# EasyEDA Pro project MicroHDMI_D-Type_Dummy_Plug.epro

# Schematic Schematic1
Board Name: Board1; Create Date: 2025-08-22; Page Name: P1; Project Name: MicroHDMI_D-Type_Dummy_Plug; Schematic Name: Schematic1; Update Date: 2025-08-22; Company: 嘉立创EDA; Page Size: A4; Version: V1.0
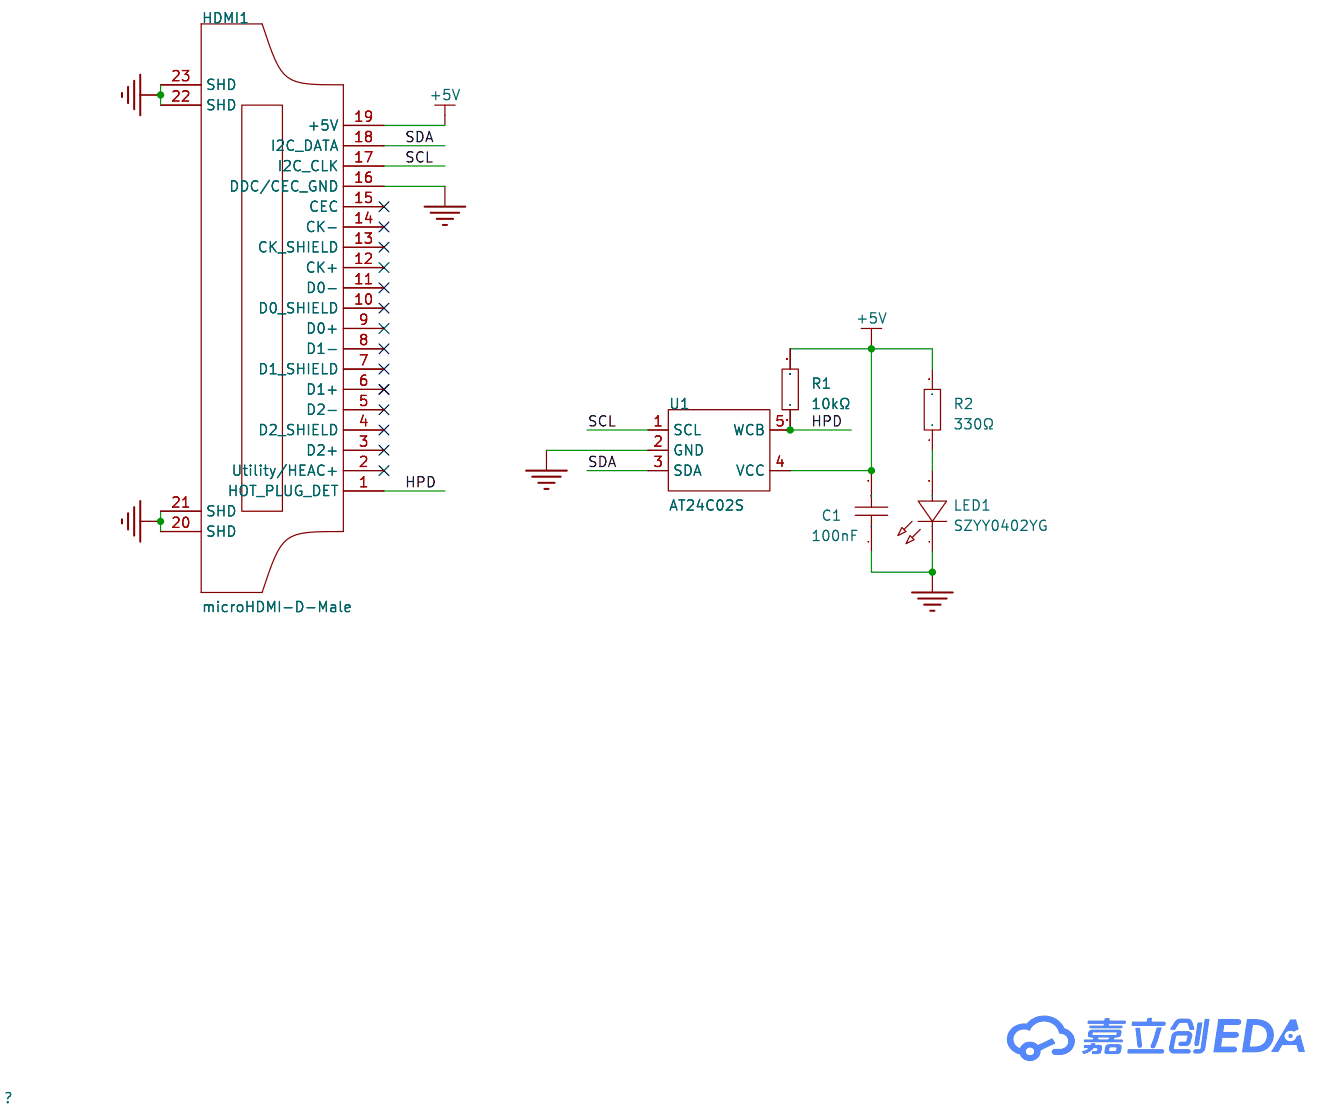
[diagram p0: schematic sheet]

## Parts
C1  100nF  [C0402]
HDMI1  microHDMI-D-Male  [HDIM-SMD_HDMI-D-Male]
LED1  SZYY0402YG  [LED0402-RD_GREEN]
R1  10kΩ  [R0402]
R2  330Ω  [R0402]
U1  AT24C02S  [SOT-23-5_L3.0-W1.7-P0.95-LS2.8-BL]

## Library data of the parts
C1 = CL05B104KO5NNNC: 容值:100nF;精度:±10%;额定电压:16V;温度系数:X7R;; LCSC Part Name: 100nF ±10% 16V; Supplier Part: C1525; Manufacturer: SAMSUNG(三星); Supplier Footprint: 0402; JLCPCB Part Class: 基础库; Datasheet: https://item.szlcsc.com/datasheet/CL05B104KO5NNNC/1877.html; Supplier: LCSC; Tolerance: ±10%; Voltage Rating: 16V; Temperature Coefficient: X7R
HDMI1 = microHDMI-D-Male: 夹板0.9镀金 2.1版本支持8k高清; Manufacturer: None; Supplier: LCSC; Supplier Part: None; Supplier Footprint: SMD; JLCPCB Part Class: Extended Part; Datasheet: None; Connector Type: HDMI-D; Gender: 公; Number of Pins: 19P; Mounting Type: 夹板; Current Rating: 500mA; Operating Temperature: -25℃~+85℃
LED1 = SZYY0402YG: 发光颜色:黄绿色;; LCSC Part Name: 普绿/黄绿; Supplier Part: C434449; Manufacturer: yongyu(永裕光电); Supplier Footprint: 0402; JLCPCB Part Class: 扩展库; Datasheet: https://atta.szlcsc.com/upload/public/pdf/source/20210222/C434449_B19755659E573AF1F9CC39D35DA2FAFF.pdf; Supplier: LCSC; Emitted Color: 黄绿色
R1 = 0402WGF1002TCE: 电阻类型:厚膜电阻;阻值:10kΩ;精度:±1%;功率:62.5mW;工作电压:50V;温度系数:±100ppm/℃;; LCSC Part Name: 10kΩ ±1% 62.5mW 厚膜电阻; Supplier Part: C25744; Manufacturer: UNI-ROYAL(厚声); Supplier Footprint: 0402; JLCPCB Part Class: 基础库; Datasheet: https://item.szlcsc.com/datasheet/0402WGF1002TCE/26487.html; Supplier: LCSC; Type: 厚膜电阻; Tolerance: ±1%; Power(Watts): 62.5mW; Voltage-Supply(Max): 50V; Temperature Coefficient: ±100ppm/℃; Operating Temperature: -55℃~+155℃
R2 = 0402WGF3300TCE: 电阻类型:厚膜电阻;阻值:330Ω;精度:±1%;功率:62.5mW;工作电压:50V;温度系数:±100ppm/℃;; LCSC Part Name: 330Ω ±1% 62.5mW 厚膜电阻; Supplier Part: C25104; Manufacturer: UNI-ROYAL(厚声); Supplier Footprint: 0402; JLCPCB Part Class: 基础库; Datasheet: https://item.szlcsc.com/datasheet/0402WGF3300TCE/25847.html; Supplier: LCSC; Type: 厚膜电阻; Tolerance: ±1%; Power(Watts): 62.5mW; Voltage-Supply(Max): 50V; Temperature Coefficient: ±100ppm/℃; Operating Temperature: -55℃~+155℃
U1 = AT24C02S: 接口类型:I2C;存储容量:2Kbit;时钟频率(fc):1MHz;; Supplier Part: C46550852; Manufacturer: TDSEMIC(拓电半导体); Supplier Footprint: SOT-23-5; JLCPCB Part Class: 扩展库; Datasheet: https://item.szlcsc.com/datasheet/AT24C02S/48682105.html; Supplier: LCSC; Interface: I2C; Memory Size: 2Kbit; Clock Frequency: 1MHz; Write Cycle Time(Tw): 5ms; Data Retention - TDR (Year): 100年; Write Cycle Endurance: 100万次; Operating Temperature: -40℃~+85℃

## Nets
+5V: C1.2 HDMI1.19(+5V) R1.2 R2.2 U1.4(VCC)
GND: C1.1 HDMI1.16(DDC/CEC_GND) HDMI1.20(SHD) HDMI1.21(SHD) HDMI1.22(SHD) HDMI1.23(SHD) LED1.1(K) U1.2(GND)
HPD: HDMI1.1(HOT_PLUG_DET) R1.1 U1.5(WCB)
SCL: HDMI1.17(I2C_CLK) U1.1(SCL)
SDA: HDMI1.18(I2C_DATA) U1.3(SDA)
$1N2501: LED1.2(A) R2.1

Not connected (* = marked no-connect by the designer): HDMI1 2(Utility/HEAC+)* 3(D2+)* 4(D2_SHIELD)* 5(D2-)* 6(D1+)* 7(D1_SHIELD)* 8(D1-)* 9(D0+)* 10(D0_SHIELD)* 11(D0-)* 12(CK+)* 13(CK_SHIELD)* 14(CK-)* 15(CEC)*

# Board PCB1
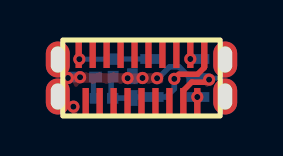
[diagram p1: board, top side]
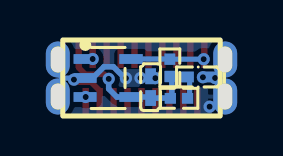
[diagram p2: board, bottom side, seen from below]

No outline. copper layers: Top Layer, Bottom Layer. Coordinates in mm from the lowest, leftmost part position.
Stack: Top Layer 0.035mm / Dielectric1 1.51mm FR4 er 4.5 / Bottom Layer 0.035mm

## Design rules (mm)
template: 自定义配置
spacing copperThickness1oz (default): track to track 0.102, other pairs 0.152 to 0.3
spacing copperThickness2oz: track to track 0.203, other pairs 0.152 to 0.3
track width copperThickness1oz (default): min 0.127, default 0.254, max 2.54
track width copperThickness2oz: min 0.203, default 0.254, max 2.54
differential pair differentialPair (default): width min 0.127, default 0.254, max 2.54; gap min 0.152, default 0.152
via viaSize (default): diameter min 0.5, default 0.61, max 10; hole min 0.3, default 0.305, max 6.3

## Placement (name value [footprint] x y rotation side)
C1  100nF  [C0402]  2.39 0.56 270 bottom
HDMI1  microHDMI-D-Male  [HDIM-SMD_HDMI-D-Male]  2.84 1.02 0 top
LED1  SZYY0402YG  [LED0402-RD_GREEN]  0 1.07 0 bottom
R1  10kΩ  [R0402]  1.42 1.52 270 bottom
R2  330Ω  [R0402]  0.97 0 0 bottom
U1  AT24C02S  [SOT-23-5_L3.0-W1.7-P0.95-LS2.8-BL]  4.52 1.02 270 bottom

## Footprints (pads in the part's own frame, mm; a bottom-side part is the same pattern mirrored in y, then rotated)
C0402
  rect 0.79x0.54 smd: 1(-0.545,0) 2(0.545,0)
HDIM-SMD_HDMI-D-Male
  rect 0.32x1.4 smd: 1(-3.15,1.2) 2(-2.8,-1.2) 3(-2.45,1.2) 4(-2.1,-1.2) 5(-1.75,1.2) 6(-1.4,-1.2) 7(-1.05,1.2) 8(-0.7,-1.2) 9(-0.35,1.2) 10(0,-1.2) 11(0.35,1.2) 12(0.7,-1.2) 13(1.05,1.2) 14(1.4,-1.2) 15(1.75,1.2) 16(2.1,-1.2) 17(2.45,1.2) 18(2.8,-1.2) 19(3.15,1.2)
  oval 1.2x1.8 hole 0.7x1.3: 20(-4.2,0.925) 21(-4.2,-0.925) 22(4.2,0.925) 23(4.2,-0.925)
LED0402-RD_GREEN
  rect 0.636x0.54 smd: 1(-0.538,0) 2(0.538,0)
R0402
  rect 0.566x0.54 smd: 1(-0.433,0) 2(0.433,0)
SOT-23-5_L3.0-W1.7-P0.95-LS2.8-BL
  rect 0.49x1.157 smd: 1(-0.95,-1.153) 2(0,-1.153) 3(0.95,-1.153)
  rect 0.49x1.175 smd: 4(0.95,1.153) 5(-0.95,1.153)

## Nets
As in the schematic.

Pads without a net: HDMI1 2 3 4 5 6 7 8 9 10 11 12 13 14 15

## Via types
v1: diameter 0.61, hole 0.305, Top Layer to Bottom Layer, 11 vias

## Routing (per net, layer and track width the routed paths; a pad name or vN(x,y) marks a point on that pad's centre or on a via; arc(x,y) is an arc through that point)
+5V: length 7.4
  Top Layer w0.28: v1(4.49,0.97) 4.72,1.2 5.66,1.2 6,1.54 HDMI1.19
  Bottom Layer w0.254: 1.32,0.02 1.3,0
  Bottom Layer w0.28: 3.37,0.07 4.08,0.07 4.49,0.48 v1(4.49,0.97) ; 3.32,0.07 2.34,0.07 2.29,0.01 1.33,0.01 1.32,0.02 1.32,1.14
GND: length 7.2
  Top Layer w0.28: v1(6.24,0.93) 6.11,0.81 5.36,0.81 4.94,0.39 HDMI1.16
  Bottom Layer w0.254: 6.79,1.01 6.8,1.01 7.04,1.25 HDMI1.22 ; 6.79,1.01 6.31,1.01 v1(6.24,0.93) ; 6.79,1.01 7.04,0.76 HDMI1.23
  Bottom Layer w0.28: 5.62,1.02 5.29,1.02 4.73,1.58 4.25,1.58 3.73,1.06 3.68,1.06 v1(3.63,1.01)
  vias: v1(-0.85,1.02) v1(-0.57,-0.42) v1(-0.24,1.05) v1(2.15,1.01) v1(2.9,1.02)
HPD: length 3.6
  Bottom Layer w0.254: 3.37,1.97 1.36,1.97 1.35,1.96 v1(-0.27,1.96)
SCL:
  vias: v1(5.29,1.97)
SDA:
  vias: v1(5.65,0.07)
$1N2501: length 1.1
  Bottom Layer w0.254: 0.43,0 0.43,0.98 0.37,1.05

## Copper pours and planes (outline as drawn; the poured copper is in the pictures)
GND on Top Layer: -1.6,2.92 7.29,2.92 7.29,-0.89 -1.6,-0.89
GND on Bottom Layer: -1.6,2.92 7.29,2.92 7.29,-0.89 -1.6,-0.89

# Board PCBA
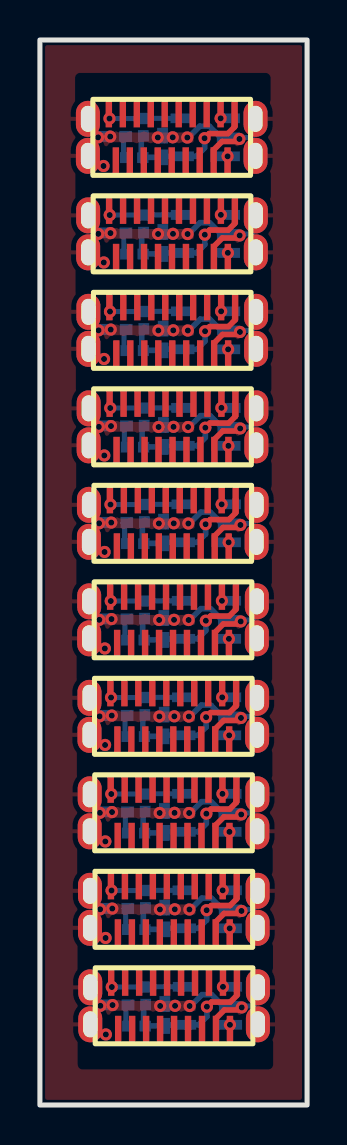
[diagram p3: board, top side]
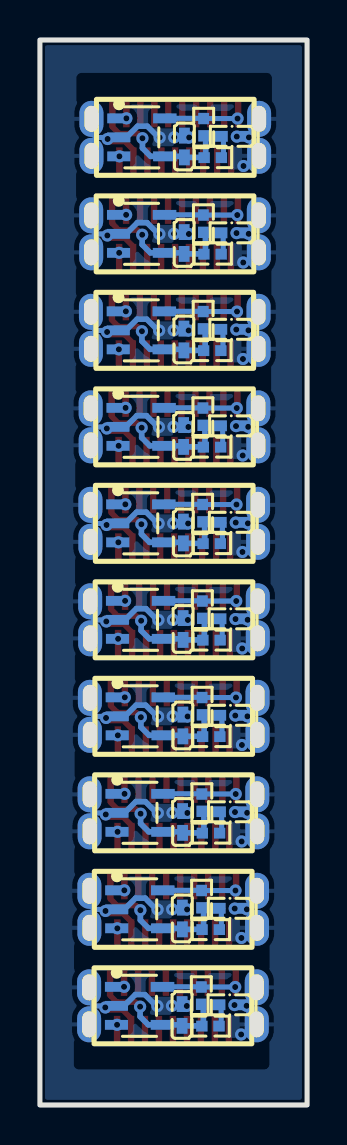
[diagram p4: board, bottom side, seen from below]

Outline 13.39 x 53.26 mm; copper layers: Top Layer, Bottom Layer. Coordinates in mm from the lower left corner of the outline.
Outline path: rectangle 0,53.26 13.39,0
Stack: Top Layer 0.035mm / Dielectric1 1.51mm FR4 er 4.5 / Bottom Layer 0.035mm

## Design rules (mm)
template: JLCPCB Capability(Two Layers Board)
spacing copperThickness1oz (default): track to track 0.102, other pairs 0.152 to 0.3
spacing copperThickness2oz: track to track 0.203, other pairs 0.152 to 0.3
track width copperThickness1oz (default): min 0.127, default 0.254, max 2.54
track width copperThickness2oz: min 0.203, default 0.254, max 2.54
differential pair differentialPair (default): width min 0.127, default 0.254, max 2.54; gap min 0.152, default 0.152
via viaSize (default): diameter min 0.5, default 0.61, max 10; hole min 0.3, default 0.305, max 6.3

## Placement (name value [footprint] x y rotation side)
C1  -  [C0402]  6.15 47.94 270 bottom
C1#2  -  [C0402]  6.16 43.11 270 bottom
C1#3  -  [C0402]  6.17 38.29 270 bottom
C1#4  -  [C0402]  6.19 33.46 270 bottom
C1#5  -  [C0402]  6.2 28.63 270 bottom
C1#6  -  [C0402]  6.21 23.81 270 bottom
C1#7  -  [C0402]  6.22 18.98 270 bottom
C1#8  -  [C0402]  6.24 14.16 270 bottom
C1#9  -  [C0402]  6.25 9.33 270 bottom
C1#10  -  [C0402]  6.26 4.5 270 bottom
HDMI1  -  [HDIM-SMD_HDMI-D-Male]  6.62 43.57 0 top
HDMI1#2  -  [HDIM-SMD_HDMI-D-Male]  6.63 38.74 0 top
HDMI1#3  -  [HDIM-SMD_HDMI-D-Male]  6.64 33.92 0 top
HDMI1#4  -  [HDIM-SMD_HDMI-D-Male]  6.66 29.09 0 top
HDMI1#5  -  [HDIM-SMD_HDMI-D-Male]  6.67 24.27 0 top
HDMI1#6  -  [HDIM-SMD_HDMI-D-Male]  6.6 48.4 0 top
HDMI1#7  -  [HDIM-SMD_HDMI-D-Male]  6.68 19.44 0 top
HDMI1#8  -  [HDIM-SMD_HDMI-D-Male]  6.69 14.61 0 top
HDMI1#9  -  [HDIM-SMD_HDMI-D-Male]  6.71 9.79 0 top
HDMI1#10  -  [HDIM-SMD_HDMI-D-Male]  6.72 4.96 0 top
LED1  -  [LED0402-RD_GREEN]  3.76 48.45 0 bottom
LED1#2  -  [LED0402-RD_GREEN]  3.77 43.62 0 bottom
LED1#3  -  [LED0402-RD_GREEN]  3.78 38.79 0 bottom
LED1#4  -  [LED0402-RD_GREEN]  3.8 33.97 0 bottom
LED1#5  -  [LED0402-RD_GREEN]  3.81 29.14 0 bottom
LED1#6  -  [LED0402-RD_GREEN]  3.82 24.32 0 bottom
LED1#7  -  [LED0402-RD_GREEN]  3.84 19.49 0 bottom
LED1#8  -  [LED0402-RD_GREEN]  3.85 14.66 0 bottom
LED1#9  -  [LED0402-RD_GREEN]  3.86 9.84 0 bottom
LED1#10  -  [LED0402-RD_GREEN]  3.88 5.01 0 bottom
R1  -  [R0402]  5.18 48.9 270 bottom
R1#2  -  [R0402]  5.19 44.08 270 bottom
R1#3  -  [R0402]  5.21 39.25 270 bottom
R1#4  -  [R0402]  5.22 34.43 270 bottom
R1#5  -  [R0402]  5.23 29.6 270 bottom
R1#6  -  [R0402]  5.25 24.77 270 bottom
R1#7  -  [R0402]  5.26 19.95 270 bottom
R1#8  -  [R0402]  5.27 15.12 270 bottom
R1#9  -  [R0402]  5.29 10.3 270 bottom
R1#10  -  [R0402]  5.3 5.47 270 bottom
R2  -  [R0402]  4.72 47.38 0 bottom
R2#2  -  [R0402]  4.74 42.55 0 bottom
R2#3  -  [R0402]  4.75 37.73 0 bottom
R2#4  -  [R0402]  4.76 32.9 0 bottom
R2#5  -  [R0402]  4.78 28.08 0 bottom
R2#6  -  [R0402]  4.79 23.25 0 bottom
R2#7  -  [R0402]  4.8 18.42 0 bottom
R2#8  -  [R0402]  4.82 13.6 0 bottom
R2#9  -  [R0402]  4.83 8.77 0 bottom
R2#10  -  [R0402]  4.84 3.95 0 bottom
U1  -  [SOT-23-5_L3.0-W1.7-P0.95-LS2.8-BL]  8.28 48.4 270 bottom
U1#2  -  [SOT-23-5_L3.0-W1.7-P0.95-LS2.8-BL]  8.29 43.57 270 bottom
U1#3  -  [SOT-23-5_L3.0-W1.7-P0.95-LS2.8-BL]  8.31 38.74 270 bottom
U1#4  -  [SOT-23-5_L3.0-W1.7-P0.95-LS2.8-BL]  8.32 33.92 270 bottom
U1#5  -  [SOT-23-5_L3.0-W1.7-P0.95-LS2.8-BL]  8.33 29.09 270 bottom
U1#6  -  [SOT-23-5_L3.0-W1.7-P0.95-LS2.8-BL]  8.35 24.27 270 bottom
U1#7  -  [SOT-23-5_L3.0-W1.7-P0.95-LS2.8-BL]  8.36 19.44 270 bottom
U1#8  -  [SOT-23-5_L3.0-W1.7-P0.95-LS2.8-BL]  8.37 14.61 270 bottom
U1#9  -  [SOT-23-5_L3.0-W1.7-P0.95-LS2.8-BL]  8.38 9.79 270 bottom
U1#10  -  [SOT-23-5_L3.0-W1.7-P0.95-LS2.8-BL]  8.4 4.96 270 bottom

## Footprints (pads in the part's own frame, mm; a bottom-side part is the same pattern mirrored in y, then rotated)
C0402
  rect 0.79x0.54 smd: 1(-0.545,0) 2(0.545,0)
HDIM-SMD_HDMI-D-Male
  rect 0.32x1.4 smd: 1(-3.15,1.2) 2(-2.8,-1.2) 3(-2.45,1.2) 4(-2.1,-1.2) 5(-1.75,1.2) 6(-1.4,-1.2) 7(-1.05,1.2) 8(-0.7,-1.2) 9(-0.35,1.2) 10(0,-1.2) 11(0.35,1.2) 12(0.7,-1.2) 13(1.05,1.2) 14(1.4,-1.2) 15(1.75,1.2) 16(2.1,-1.2) 17(2.45,1.2) 18(2.8,-1.2) 19(3.15,1.2)
  oval 1.2x1.8 hole 0.7x1.3: 20(-4.2,0.925) 21(-4.2,-0.925) 22(4.2,0.925) 23(4.2,-0.925)
LED0402-RD_GREEN
  rect 0.636x0.54 smd: 1(-0.538,0) 2(0.538,0)
R0402
  rect 0.566x0.54 smd: 1(-0.433,0) 2(0.433,0)
SOT-23-5_L3.0-W1.7-P0.95-LS2.8-BL
  rect 0.49x1.157 smd: 1(-0.95,-1.153) 2(0,-1.153) 3(0.95,-1.153)
  rect 0.49x1.175 smd: 4(0.95,1.153) 5(-0.95,1.153)

## Nets
+5V: C1.2 C1#2.2 C1#3.2 C1#4.2 C1#5.2 C1#6.2 C1#7.2 C1#8.2 C1#9.2 C1#10.2 HDMI1.19 HDMI1#2.19 HDMI1#3.19 HDMI1#4.19 HDMI1#5.19 HDMI1#6.19 HDMI1#7.19 HDMI1#8.19 HDMI1#9.19 HDMI1#10.19 R1.2 R1#2.2 R1#3.2 R1#4.2 R1#5.2 R1#6.2 R1#7.2 R1#8.2 R1#9.2 R1#10.2 R2.2 R2#2.2 R2#3.2 R2#4.2 R2#5.2 R2#6.2 R2#7.2 R2#8.2 R2#9.2 R2#10.2 U1.4 U1#2.4 U1#3.4 U1#4.4 U1#5.4 U1#6.4 U1#7.4 U1#8.4 U1#9.4 U1#10.4
GND: C1.1 C1#2.1 C1#3.1 C1#4.1 C1#5.1 C1#6.1 C1#7.1 C1#8.1 C1#9.1 C1#10.1 HDMI1.16 HDMI1.20 HDMI1.21 HDMI1.22 HDMI1.23 HDMI1#2.16 HDMI1#2.20 HDMI1#2.21 HDMI1#2.22 HDMI1#2.23 HDMI1#3.16 HDMI1#3.20 HDMI1#3.21 HDMI1#3.22 HDMI1#3.23 HDMI1#4.16 HDMI1#4.20 HDMI1#4.21 HDMI1#4.22 HDMI1#4.23 HDMI1#5.16 HDMI1#5.20 HDMI1#5.21 HDMI1#5.22 HDMI1#5.23 HDMI1#6.16 HDMI1#6.20 HDMI1#6.21 HDMI1#6.22 HDMI1#6.23 HDMI1#7.16 HDMI1#7.20 HDMI1#7.21 HDMI1#7.22 HDMI1#7.23 HDMI1#8.16 HDMI1#8.20 HDMI1#8.21 HDMI1#8.22 HDMI1#8.23 HDMI1#9.16 HDMI1#9.20 HDMI1#9.21 HDMI1#9.22 HDMI1#9.23 HDMI1#10.16 HDMI1#10.20 HDMI1#10.21 HDMI1#10.22 HDMI1#10.23 LED1.1 LED1#2.1 LED1#3.1 LED1#4.1 LED1#5.1 LED1#6.1 LED1#7.1 LED1#8.1 LED1#9.1 LED1#10.1 U1.2 U1#2.2 U1#3.2 U1#4.2 U1#5.2 U1#6.2 U1#7.2 U1#8.2 U1#9.2 U1#10.2
HPD: HDMI1.1 HDMI1#2.1 HDMI1#3.1 HDMI1#4.1 HDMI1#5.1 HDMI1#6.1 HDMI1#7.1 HDMI1#8.1 HDMI1#9.1 HDMI1#10.1 R1.1 R1#2.1 R1#3.1 R1#4.1 R1#5.1 R1#6.1 R1#7.1 R1#8.1 R1#9.1 R1#10.1 U1.5 U1#2.5 U1#3.5 U1#4.5 U1#5.5 U1#6.5 U1#7.5 U1#8.5 U1#9.5 U1#10.5
SCL: HDMI1.17 HDMI1#2.17 HDMI1#3.17 HDMI1#4.17 HDMI1#5.17 HDMI1#6.17 HDMI1#7.17 HDMI1#8.17 HDMI1#9.17 HDMI1#10.17 U1.1 U1#2.1 U1#3.1 U1#4.1 U1#5.1 U1#6.1 U1#7.1 U1#8.1 U1#9.1 U1#10.1
SDA: HDMI1.18 HDMI1#2.18 HDMI1#3.18 HDMI1#4.18 HDMI1#5.18 HDMI1#6.18 HDMI1#7.18 HDMI1#8.18 HDMI1#9.18 HDMI1#10.18 U1.3 U1#2.3 U1#3.3 U1#4.3 U1#5.3 U1#6.3 U1#7.3 U1#8.3 U1#9.3 U1#10.3
$1N2501: LED1.2 LED1#2.2 LED1#3.2 LED1#4.2 LED1#5.2 LED1#6.2 LED1#7.2 LED1#8.2 LED1#9.2 LED1#10.2 R2.1 R2#2.1 R2#3.1 R2#4.1 R2#5.1 R2#6.1 R2#7.1 R2#8.1 R2#9.1 R2#10.1

Pads without a net: HDMI1 2 3 4 5 6 7 8 9 10 11 12 13 14 15; HDMI1#2 2 3 4 5 6 7 8 9 10 11 12 13 14 15; HDMI1#3 2 3 4 5 6 7 8 9 10 11 12 13 14 15; HDMI1#4 2 3 4 5 6 7 8 9 10 11 12 13 14 15; HDMI1#5 2 3 4 5 6 7 8 9 10 11 12 13 14 15; HDMI1#6 2 3 4 5 6 7 8 9 10 11 12 13 14 15; HDMI1#7 2 3 4 5 6 7 8 9 10 11 12 13 14 15; HDMI1#8 2 3 4 5 6 7 8 9 10 11 12 13 14 15; HDMI1#9 2 3 4 5 6 7 8 9 10 11 12 13 14 15; HDMI1#10 2 3 4 5 6 7 8 9 10 11 12 13 14 15

## Via types
v1: diameter 0.61, hole 0.305, Top Layer to Bottom Layer, 110 vias

## Routing (per net, layer and track width the routed paths; a pad name or vN(x,y) marks a point on that pad's centre or on a via; arc(x,y) is an arc through that point)
+5V: length 73.8
  Top Layer w0.28: HDMI1#10.19 9.87,5.48 9.54,5.15 8.6,5.15 v1(8.37,4.92) ; v1(8.34,14.57) 8.57,14.8 9.51,14.8 9.84,15.13 HDMI1#8.19 ; HDMI1#9.19 9.86,10.31 9.53,9.98 8.59,9.98 v1(8.35,9.74) ; v1(8.26,43.53) 8.49,43.76 9.43,43.76 9.77,44.09 9.77,44.77 ; 9.79,35.12 9.79,34.44 9.46,34.11 8.52,34.11 v1(8.29,33.87) ; HDMI1#6.19 9.75,48.92 9.42,48.58 8.48,48.58 v1(8.25,48.35) ; v1(8.28,38.7) 8.51,38.93 9.45,38.93 9.78,39.26 HDMI1#2.19 ; v1(8.3,29.05) 8.53,29.28 9.47,29.28 9.81,29.61 HDMI1#4.19 ; v1(8.31,24.22) 8.55,24.45 9.49,24.45 9.82,24.79 9.82,25.47 ; v1(8.33,19.4) 8.56,19.63 9.5,19.63 9.83,19.96 HDMI1#7.19
  Bottom Layer w0.254: 5.13,28.1 5.11,28.08 ; 5.11,37.75 5.08,37.73 ; 5.17,13.62 5.15,13.6 ; 5.15,23.27 5.12,23.25 ; 5.08,47.4 5.06,47.38 ; 5.18,8.8 5.16,8.77 ; 5.09,42.58 5.07,42.55 ; 5.16,18.45 5.13,18.42 ; 5.2,3.97 5.17,3.95 ; 5.12,32.93 5.09,32.9
  Bottom Layer w0.28: U1#2.4 7.85,42.62 8.26,43.03 v1(8.26,43.53) ; 7.14,23.32 6.16,23.32 6.11,23.26 5.16,23.26 5.15,23.27 5.15,24.39 ; 5.13,29.22 5.13,28.1 5.14,28.09 6.1,28.09 6.15,28.14 7.13,28.14 ; U1.4 7.84,47.45 8.25,47.86 v1(8.25,48.35) ; U1#4.4 7.88,32.97 8.29,33.38 v1(8.29,33.87) ; U1#3.4 7.86,37.79 8.28,38.2 v1(8.28,38.7) ; 7.17,13.66 6.19,13.66 6.14,13.61 5.18,13.61 5.17,13.62 5.17,14.74 ; v1(8.34,14.57) 8.34,14.07 7.93,13.66 U1#8.4 ; 7.1,37.79 6.12,37.79 6.07,37.74 5.12,37.74 5.11,37.75 5.11,38.87 ; 5.2,5.09 5.2,3.97 5.21,3.96 6.16,3.96 6.21,4.01 7.19,4.01 ; 5.08,48.52 5.08,47.4 5.09,47.39 6.04,47.39 6.1,47.45 7.08,47.45 ; 7.12,32.97 6.14,32.97 6.08,32.92 5.13,32.92 5.12,32.93 5.12,34.04 ; 7.18,28.14 7.89,28.14 8.3,28.55 v1(8.3,29.05) ; 5.16,19.57 5.16,18.45 5.17,18.44 6.12,18.44 6.18,18.49 7.15,18.49 ; 7.18,8.84 6.2,8.84 6.15,8.79 5.19,8.79 5.18,8.8 5.18,9.91 ; v1(8.33,19.4) 8.33,18.9 7.92,18.49 U1#7.4 ; U1#6.4 7.9,23.32 8.31,23.73 v1(8.31,24.22) ; 7.23,8.84 7.94,8.84 8.35,9.25 v1(8.35,9.74) ; 5.09,43.7 5.09,42.58 5.1,42.57 6.06,42.57 6.11,42.62 7.09,42.62 ; U1#10.4 7.96,4.01 8.37,4.42 v1(8.37,4.92)
GND: length 72.1
  Top Layer w0.28: HDMI1#7.16 8.78,18.81 9.2,19.23 9.95,19.23 v1(10.07,19.36) ; HDMI1#5.16 8.77,23.64 9.19,24.06 9.93,24.06 v1(10.06,24.18) ; HDMI1#9.16 8.81,9.16 9.23,9.58 9.97,9.58 v1(10.1,9.71) ; HDMI1#10.16 8.82,4.33 9.24,4.75 9.99,4.75 v1(10.11,4.88) ; HDMI1.16 8.72,42.94 9.14,43.36 9.88,43.36 v1(10.01,43.49) ; v1(10.05,29.01) 9.92,28.88 9.18,28.88 8.76,28.46 HDMI1#4.16 ; HDMI1#2.16 8.73,38.12 9.15,38.54 9.89,38.54 v1(10.02,38.66) ; v1(10.03,33.84) 9.91,33.71 9.16,33.71 8.74,33.29 HDMI1#3.16 ; HDMI1#6.16 8.7,47.77 9.12,48.19 9.87,48.19 v1(10,48.31) ; v1(10.09,14.53) 9.96,14.41 9.21,14.41 8.79,13.99 HDMI1#8.16
  Bottom Layer w0.254: HDMI1#5.23 10.87,24.01 10.62,24.26 ; HDMI1#3.22 10.84,34.16 10.6,33.91 10.59,33.91 ; 10.64,14.61 10.65,14.61 10.9,14.85 10.9,15.54 ; 10.64,14.61 10.16,14.61 v1(10.09,14.53) ; 10.64,14.61 10.9,14.35 10.9,13.69 ; 10.65,9.78 10.18,9.78 v1(10.1,9.71) ; 10.65,9.78 10.66,9.78 10.91,10.03 HDMI1#9.22 ; 10.65,9.78 10.91,9.53 HDMI1#9.23 ; HDMI1#5.22 10.87,24.5 10.63,24.26 10.62,24.26 ; v1(10.05,29.01) 10.12,29.09 10.6,29.09 ; v1(10.01,43.49) 10.08,43.56 10.56,43.56 ; 10.55,48.39 10.56,48.39 10.8,48.63 HDMI1#6.22 ; 10.55,48.39 10.8,48.14 HDMI1#6.23 ; 10.55,48.39 10.07,48.39 v1(10,48.31) ; HDMI1#4.23 10.86,28.83 10.6,29.09 ; HDMI1#7.22 10.88,19.68 10.64,19.43 10.63,19.43 ; 10.6,29.09 10.61,29.09 10.86,29.33 HDMI1#4.22 ; v1(10.11,4.88) 10.19,4.96 10.67,4.96 ; HDMI1#10.22 10.92,5.2 10.68,4.96 10.67,4.96 ; 10.67,4.96 10.92,4.7 HDMI1#10.23 ; 10.59,33.91 10.11,33.91 v1(10.03,33.84) ; 10.59,33.91 10.84,33.66 HDMI1#3.23 ; 10.63,19.43 10.15,19.43 v1(10.07,19.36) ; 10.63,19.43 10.88,19.18 HDMI1#7.23 ; 10.62,24.26 10.14,24.26 v1(10.06,24.18) ; HDMI1.23 10.82,43.31 10.56,43.56 ; v1(10.02,38.66) 10.1,38.74 10.58,38.74 ; 10.58,38.74 10.83,38.48 HDMI1#2.23 ; 10.58,38.74 10.59,38.74 10.83,38.98 HDMI1#2.22 ; 10.56,43.56 10.57,43.56 10.82,43.81 HDMI1.22
  Bottom Layer w0.28: v1(7.39,48.39) 7.44,48.44 7.49,48.44 8.01,48.95 8.49,48.95 9.05,48.4 9.38,48.4 ; 9.4,43.57 9.06,43.57 8.5,44.13 8.02,44.13 7.5,43.61 7.45,43.61 v1(7.4,43.56) ; v1(7.5,4.95) 7.55,5 7.61,5 8.13,5.52 8.61,5.52 9.17,4.96 9.5,4.96 ; 9.47,14.61 9.14,14.61 8.58,15.17 8.1,15.17 7.58,14.65 7.53,14.65 v1(7.48,14.6) ; v1(7.44,29.08) 7.49,29.13 7.54,29.13 8.06,29.65 8.54,29.65 9.1,29.09 9.44,29.09 ; v1(7.41,38.73) 7.46,38.78 7.52,38.78 8.03,39.3 8.52,39.3 9.07,38.74 9.41,38.74 ; v1(7.49,9.78) 7.54,9.83 7.59,9.83 8.11,10.35 8.59,10.35 9.15,9.79 9.49,9.79 ; v1(7.46,19.43) 7.51,19.48 7.57,19.48 8.09,20 8.57,20 9.13,19.44 9.46,19.44 ; 9.42,33.92 9.09,33.92 8.53,34.48 8.05,34.48 7.53,33.96 7.48,33.96 v1(7.42,33.91) ; v1(7.45,24.26) 7.5,24.31 7.56,24.31 8.07,24.82 8.56,24.82 9.11,24.27 9.45,24.27
  vias: v1(2.91,48.4) v1(2.93,43.57) v1(2.94,38.74) v1(2.95,33.92) v1(2.96,29.09) v1(2.98,24.27) v1(2.99,19.44) v1(3,14.61) v1(3.02,9.79) v1(3.03,4.96) v1(3.19,46.96) v1(3.2,42.14) v1(3.21,37.31) v1(3.23,32.48) v1(3.24,27.66) v1(3.25,22.83) v1(3.26,18.01) v1(3.28,13.18) v1(3.29,8.35) v1(3.3,3.53) v1(3.52,48.43) v1(3.53,43.61) v1(3.55,38.78) v1(3.56,33.95) v1(3.57,29.13) v1(3.59,24.3) v1(3.6,19.48) v1(3.61,14.65) v1(3.63,9.82) v1(3.64,5) v1(5.91,48.39) v1(5.92,43.56) v1(5.93,38.74) v1(5.95,33.91) v1(5.96,29.08) v1(5.97,24.26) v1(5.99,19.43) v1(6,14.61) v1(6.01,9.78) v1(6.03,4.95) v1(6.66,48.4) v1(6.67,43.57) v1(6.68,38.74) v1(6.69,33.92) v1(6.71,29.09) v1(6.72,24.27) v1(6.73,19.44) v1(6.75,14.61) v1(6.76,9.79) v1(6.77,4.96)
HPD: length 36.5
  Bottom Layer w0.254: U1#7.5 5.2,20.39 5.19,20.38 v1(3.56,20.38) ; v1(3.58,15.55) 5.2,15.55 5.21,15.56 U1#8.5 ; 7.23,10.74 5.23,10.74 5.22,10.73 v1(3.59,10.73) ; v1(3.54,30.03) 5.16,30.03 5.17,30.04 7.18,30.04 ; v1(3.52,34.86) 5.15,34.86 5.16,34.87 U1#4.5 ; U1#3.5 5.15,39.69 5.14,39.68 v1(3.51,39.68) ; U1#2.5 5.13,44.52 5.12,44.51 v1(3.5,44.51) ; U1#6.5 5.19,25.22 5.18,25.21 v1(3.55,25.21) ; v1(3.49,49.34) 5.11,49.34 5.12,49.35 U1.5 ; v1(3.6,5.9) 5.23,5.9 5.24,5.91 U1#10.5
SCL:
  vias: v1(9.05,49.35) v1(9.07,44.52) v1(9.08,39.69) v1(9.09,34.87) v1(9.11,30.04) v1(9.12,25.22) v1(9.13,20.39) v1(9.15,15.56) v1(9.16,10.74) v1(9.17,5.91)
SDA:
  vias: v1(9.4,47.45) v1(9.42,42.62) v1(9.43,37.79) v1(9.44,32.97) v1(9.46,28.14) v1(9.47,23.32) v1(9.48,18.49) v1(9.5,13.66) v1(9.51,8.84) v1(9.52,4.01)
$1N2501: length 10.7
  Bottom Layer w0.254: 4.24,4.99 4.31,4.93 4.31,3.95 ; 4.23,32.9 4.23,33.88 4.16,33.95 ; 4.22,14.64 4.28,14.58 4.28,13.6 ; 4.19,47.38 4.19,48.36 4.12,48.43 ; 4.2,42.55 4.2,43.53 4.14,43.6 ; 4.29,8.77 4.29,9.75 4.23,9.82 ; 4.22,37.73 4.22,38.71 4.15,38.77 ; 4.19,24.3 4.25,24.23 4.25,23.25 ; 4.2,19.47 4.27,19.4 4.27,18.42 ; 4.18,29.12 4.24,29.06 4.24,28.08

## Copper pours and planes (outline as drawn; the poured copper is in the pictures)
GND on Top Layer: 0,53.26 13.39,53.26 13.39,0 0,0
GND on Bottom Layer: 0,53.26 13.39,53.26 13.39,0 0,0
